# Altium schematic sheet MicroMultimeter_MCU_Sch.SchDoc: MicroMultimeter - MCU
size 127 x 127 mm; Author: Hom; CompanyName: KitSprout; DrawnBy: Hom; Engineer: Hom; Organization: KitSprout; Revision: A; SheetNumber: 1; SheetTotal: 1; License: CC BY-SA 4.0; Version: 1.0; LibVersion: 1.4; PageSetup: Record=PageOptions|CenterHorizontal=True|CenterVertical=True|PrintScale=1.00|XCorrection=1.00|YCorrection=1.00|PrintKind=0|BorderSize=5000000|LeftOffset=0|BottomOffset=0|Orientation=2|PaperLength=1000|PaperWidth=1000|Scale=100|PaperSource=7|PrintQuality=-3|MediaType=1|DitherType=10|PrintScaleMode=0|PaperKind=A4|PaperIndex=9
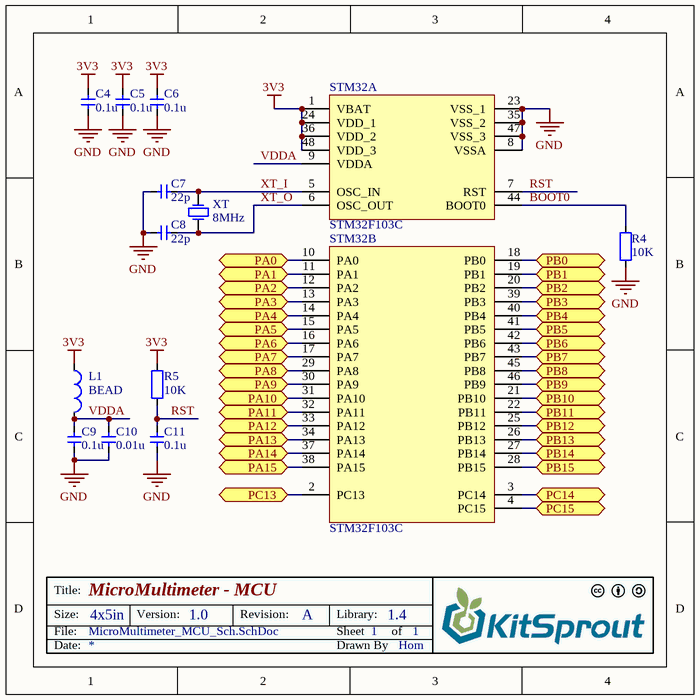
[diagram p0: MicroMultimeter_MCU_Sch.SchDoc]

## Parts
C4  value 0.1u  [CAP_0603]  (hidden comment: Cap_0603)
C5  value 0.1u  [CAP_0603]  (hidden comment: Cap_0603)
C6  value 0.1u  [CAP_0603]  (hidden comment: Cap_0603)
C7  value 22p  [CAP_0603]  (hidden comment: Cap_0603)
C8  value 22p  [CAP_0603]  (hidden comment: Cap_0603)
C9  value 0.1u  [CAP_0603]  (hidden comment: Cap_0603)
C10  value 0.01u  [CAP_0603]  (hidden comment: Cap_0603)
C11  value 0.1u  [CAP_0603]  (hidden comment: Cap_0603)
L1  value BEAD  [IND_0603]  (hidden comment: Ind_0603)
R4  value 10K  [RES_0603]  (hidden comment: Res_0603)
R5  value 10K  [RES_0603]  (hidden comment: Res_0603)
STM32  STM32F103C  [LQFP_P0.5_48]  (parts A,B of 2)
XT  value 8MHz  [XT_5032_2]  (hidden comment: XTAL_5032_2P)

## Ports
PA0, PA1, PA2, PA3, PA4, PA5, PA6, PA7, PA8, PA9, PA10, PA11, PA12, PA13, PA14, PA15, PB0, PB1, PB2, PB3, PB4, PB5, PB6, PB7, PB8, PB9, PB10, PB11, PB12, PB13, PB14, PB15, PC13, PC14, PC15

## Nets
3V3: C4.2 C5.2 C6.2 L1.1 R5.2 STM32.1(VBAT) STM32.24(VDD_1) STM32.36(VDD_2) STM32.48(VDD_3)
GND: C4.1 C5.1 C6.1 C7.2 C8.2 C9.1 C10.1 C11.1 R4.1 STM32.8(VSSA) STM32.23(VSS_1) STM32.35(VSS_2) STM32.47(VSS_3)
BOOT0: R4.2 STM32.44(BOOT0)
PA0: STM32.10(PA0) ; port PA0
PA1: STM32.11(PA1) ; port PA1
PA2: STM32.12(PA2) ; port PA2
PA3: STM32.13(PA3) ; port PA3
PA4: STM32.14(PA4) ; port PA4
PA5: STM32.15(PA5) ; port PA5
PA6: STM32.16(PA6) ; port PA6
PA7: STM32.17(PA7) ; port PA7
PA8: STM32.29(PA8) ; port PA8
PA9: STM32.30(PA9) ; port PA9
PA10: STM32.31(PA10) ; port PA10
PA11: STM32.32(PA11) ; port PA11
PA12: STM32.33(PA12) ; port PA12
PA13: STM32.34(PA13) ; port PA13
PA14: STM32.37(PA14) ; port PA14
PA15: STM32.38(PA15) ; port PA15
PB0: STM32.18(PB0) ; port PB0
PB1: STM32.19(PB1) ; port PB1
PB2: STM32.20(PB2) ; port PB2
PB3: STM32.39(PB3) ; port PB3
PB4: STM32.40(PB4) ; port PB4
PB5: STM32.41(PB5) ; port PB5
PB6: STM32.42(PB6) ; port PB6
PB7: STM32.43(PB7) ; port PB7
PB8: STM32.45(PB8) ; port PB8
PB9: STM32.46(PB9) ; port PB9
PB10: STM32.21(PB10) ; port PB10
PB11: STM32.22(PB11) ; port PB11
PB12: STM32.25(PB12) ; port PB12
PB13: STM32.26(PB13) ; port PB13
PB14: STM32.27(PB14) ; port PB14
PB15: STM32.28(PB15) ; port PB15
PC13: STM32.2(PC13) ; port PC13
PC14: STM32.3(PC14) ; port PC14
PC15: STM32.4(PC15) ; port PC15
RST: C11.2 R5.1 STM32.7(RST)
VDDA: C9.2 C10.2 L1.2 STM32.9(VDDA)
XT_I: C7.1 STM32.5(OSC_IN) XT.2(OSC2)
XT_O: C8.1 STM32.6(OSC_OUT) XT.1(OSC1)

## Notes on the sheet
- Title:
- Size:
- Date:
- File:
- 4x5in
- Version:
- Revision:
- Sheet
- Drawn By
- Library:
- of

## Library data of the parts
C4-C11 = Cap_0603: Capacitor
L1 = Ind_0603: Inductor
R4 R5 = Res_0603: Resistor
STM32 = STM32F103C: MCU
XT = XTAL_5032_2P: Crystal Oscillator